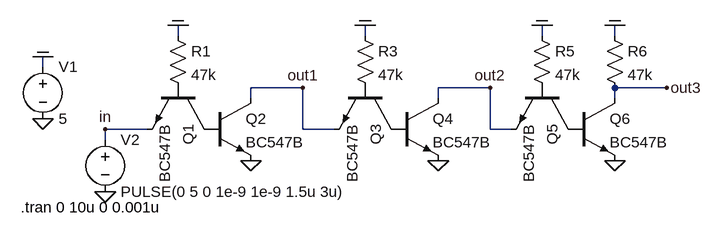
[diagram p0: schematic ttl3.asc]
ttl3.asc, the LTspice schematic file:
Version 4
SHEET 1 880 680
WIRE -96 64 -96 48
WIRE 192 64 192 48
WIRE 464 64 464 48
WIRE 576 64 576 48
WIRE -304 112 -304 96
WIRE 96 144 16 144
WIRE 384 144 304 144
WIRE 656 144 576 144
WIRE 16 160 16 144
WIRE 304 160 304 144
WIRE 576 160 576 144
WIRE -144 208 -208 208
WIRE 96 208 96 144
WIRE 144 208 96 208
WIRE 384 208 384 144
WIRE 416 208 384 208
WIRE -208 224 -208 208
FLAG -304 192 0
FLAG -304 96 COM
FLAG 16 256 0
FLAG -208 304 0
FLAG -96 48 COM
FLAG -208 208 in
FLAG 304 256 0
FLAG 192 48 COM
FLAG 576 256 0
FLAG 464 48 COM
FLAG 576 48 COM
FLAG 96 144 out1
FLAG 384 144 out2
FLAG 656 144 out3
SYMBOL voltage -304 96 R0
WINDOW 123 0 0 Left 2
WINDOW 39 0 0 Left 2
SYMATTR InstName V1
SYMATTR Value 5
SYMBOL res -112 48 R0
SYMATTR InstName R1
SYMATTR Value 47k
SYMBOL npn -48 144 R90
SYMATTR InstName Q1
SYMATTR Value BC547B
SYMBOL npn -48 160 R0
SYMATTR InstName Q2
SYMATTR Value BC547B
SYMBOL voltage -208 208 R0
WINDOW 123 0 0 Left 2
WINDOW 39 0 0 Left 2
SYMATTR InstName V2
SYMATTR Value PULSE(0 5 0 1e-9 1e-9 1.5u 3u)
SYMBOL res 176 48 R0
SYMATTR InstName R3
SYMATTR Value 47k
SYMBOL npn 240 144 R90
SYMATTR InstName Q3
SYMATTR Value BC547B
SYMBOL npn 240 160 R0
SYMATTR InstName Q4
SYMATTR Value BC547B
SYMBOL res 448 48 R0
SYMATTR InstName R5
SYMATTR Value 47k
SYMBOL npn 512 144 R90
SYMATTR InstName Q5
SYMATTR Value BC547B
SYMBOL npn 512 160 R0
SYMATTR InstName Q6
SYMATTR Value BC547B
SYMBOL res 560 48 R0
SYMATTR InstName R6
SYMATTR Value 47k
TEXT -338 328 Left 2 !.tran 0 10u 0 0.001u

The netlist it stands for:
* ttl3.asc
V1 COM 0 5
R1 COM P001 47k
Q1 P002 P001 in 0 BC547B
Q2 out1 P002 0 0 BC547B
V2 in 0 PULSE(0 5 0 1e-9 1e-9 1.5u 3u)
R3 COM P003 47k
Q3 P004 P003 out1 0 BC547B
Q4 out2 P004 0 0 BC547B
R5 COM P005 47k
Q5 P006 P005 out2 0 BC547B
Q6 out3 P006 0 0 BC547B
R6 COM out3 47k
.model NPN NPN
.model PNP PNP
.lib standard.bjt
.tran 0 10u 0 0.001u
.backanno
.end